# Altium schematic sheet Sensor.SchDoc
size A4; SheetNumber: 2; SheetTotal: 5; SPICEModelCacheXYVLXKKP: <root> / <DocumentId>XYVLXKKP</DocumentId> / <CacheFrame Number="0"> / <Model Name="2n3904" Kind="MDL"> / <Text>*2N3904 / *Si 310mW  40V 200mA 300MHz pkg:TO-92B 1,2,3 / .MODEL 2N3904 NPN(IS=1.4E-14 BF=300 VAF=100 IKF=0.025 ISE=3E-13 / + BR=7.5 RC=2.4 CJE=4.5E-12 TF=4E-10 CJC=3.5E-12 TR=2.1E-8 XTB=1.5 KF=9E-16 )</Text> / </Model> / </CacheFrame> / </root>
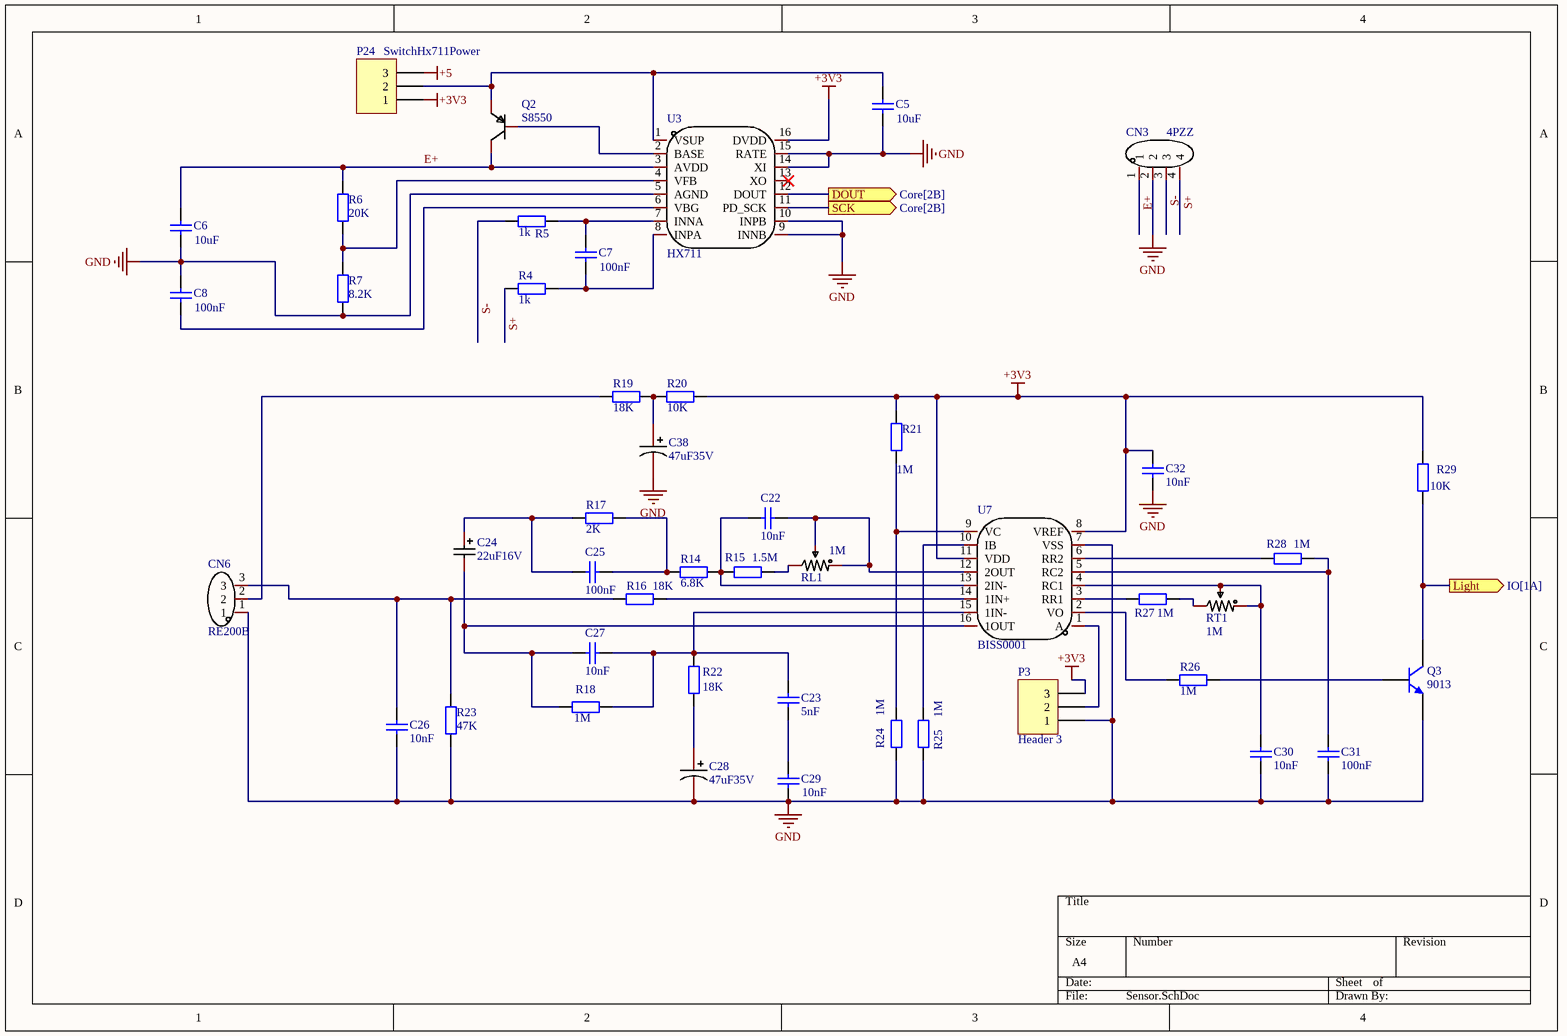
[diagram p0: Sensor.SchDoc]

## Parts
C5  value 10uF  [6-0805_N]  (hidden comment: Cap)
C6  value 10uF  [6-0805_N]  (hidden comment: Cap)
C7  value 100nF  [6-0805_N]  (hidden comment: Cap)
C8  value 100nF  [6-0805_N]  (hidden comment: Cap)
C22  value 10nF  [6-0805_N]  (hidden comment: Cap)
C23  value 5nF  [6-0805_N]  (hidden comment: Cap)
C24  Name: 22uF16V  [CASE-B_3528]  (hidden comment: 22uF)
C25  value 100nF  [6-0805_N]  (hidden comment: Cap)
C26  value 10nF  [6-0805_N]  (hidden comment: Cap)
C27  value 10nF  [6-0805_N]  (hidden comment: Cap)
C28  Name: 47uF35V  [CAP-TH_BD5.0-P2.00-D0.5-FD-A]  (hidden comment: 47uF)
C29  value 10nF  [6-0805_N]  (hidden comment: Cap)
C30  value 10nF  [6-0805_N]  (hidden comment: Cap)
C31  value 100nF  [6-0805_N]  (hidden comment: Cap)
C32  value 10nF  [6-0805_N]  (hidden comment: Cap)
C38  Name: 47uF35V  [CAP-TH_BD5.0-P2.00-D0.5-FD-A]  (hidden comment: 47uF)
CN3  Name: 4PZZ  [CONN-TH_4P-P2.50_4PIN]  (hidden comment: ZX-XH2.54-4PZZ)
CN6  Name: RE200B  [CONN-TH_3P-P2.54_2501S-3P]  (hidden comment: ZX-XH2.54-3PZZ)
P3  Header 3  [HDR1X3]
P24  SwitchHx711Power  [HDR1X3]
Q2  S8550  [SOT-23-3_L2.9-W1.3-P1.90-LS2.4-BR]
Q3  9013  [SOT-23-3_L2.9-W1.3-P1.90-LS2.4-BR]
R4  value 1k  [6-0805_N]  (hidden comment: Res2)
R5  value 1k  [6-0805_N]  (hidden comment: Res2)
R6  value 20K  [6-0805_N]  (hidden comment: Res2)
R7  value 8.2K  [6-0805_N]  (hidden comment: Res2)
R14  value 6.8K  [6-0805_N]  (hidden comment: Res2)
R15  value 1.5M  [6-0805_N]  (hidden comment: Res2)
R16  value 18K  [6-0805_N]  (hidden comment: Res2)
R17  value 2K  [6-0805_N]  (hidden comment: Res2)
R18  value 1M  [6-0805_N]  (hidden comment: Res2)
R19  value 18K  [6-0805_N]  (hidden comment: Res2)
R20  value 10K  [6-0805_N]  (hidden comment: Res2)
R21  value 1M  [6-0805_N]  (hidden comment: Res2)
R22  value 18K  [6-0805_N]  (hidden comment: Res2)
R23  value 47K  [6-0805_N]  (hidden comment: Res2)
R24  value 1M  [6-0805_N]  (hidden comment: Res2)
R25  value 1M  [6-0805_N]  (hidden comment: Res2)
R26  value 1M  [6-0805_N]  (hidden comment: Res2)
R27  value 1M  [6-0805_N]  (hidden comment: Res2)
R28  value 1M  [6-0805_N]  (hidden comment: Res2)
R29  value 10K  [6-0805_N]  (hidden comment: Res2)
RL1  Name: 1M  [RES-ADJ-TH_3P-L10.0-W10.0-P2.50-L]  (hidden comment: 10kΩ)
RT1  Name: 1M  [RES-ADJ-TH_3P-L10.0-W10.0-P2.50-L]  (hidden comment: 10kΩ)
U3  HX711  [SOP-16_L10.0-W3.9-P1.27-LS6.0-BL]
U7  BISS0001  [SOP-16_L10.0-W3.9-P1.27-LS6.0-BL]

## Ports
DOUT (out, see Core[2B]), Light (out, see IO[1A]), SCK (out, see Core[2B])

## Nets
+3V3: C32.1 P3.3 P24.1 R20.2 R21.1 R29.1 U3.16(DVDD) U7.8(VREF) U7.11(VDD)
+5: P24.3
GND: C5.1 C6.1 C8.2 C26.2 C28.2 C29.1 C30.2 C31.2 C32.2 C38.2 CN3.2 CN6.1 P3.1 Q3.1(E) R7.1 R23.2 R24.2 R25.2 U3.5(AGND) U3.9(INNB) U3.10(INPB) U3.14(XI) U3.15(RATE) U7.7(VSS)
DOUT: U3.12(DOUT) ; port DOUT
E+: C6.2 CN3.1 Q2.3(C) R6.1 U3.3(AVDD)
Light: Q3.3(C) R29.2 ; port Light
S+: CN3.4 R4.2
S-: CN3.3 R5.2
SCK: U3.11(PD_SCK) ; port SCK
NetC5_2: C5.2 P24.2 Q2.2(E) U3.1(VSUP)
NetC7_1: C7.1 R4.1 U3.8(INPA)
NetC7_2: C7.2 R5.1 U3.7(INNA)
NetC8_1: C8.1 U3.6(VBG)
NetC22_1: C22.1 R14.2 R15.1 U7.13(2IN-)
NetC22_2: C22.2 RL1.1 RL1.2 U7.12(2OUT)
NetC23_1: C23.1 C27.1 R18.1 R22.1 U7.15(1IN-)
NetC23_2: C23.2 C29.2
NetC24_1: C24.1 C25.1 R17.1
NetC24_2: C24.2 C27.2 R18.2 U7.16(1OUT)
NetC25_2: C25.2 R14.1 R17.2
NetC26_1: C26.1 CN6.3 R16.2 R23.1
NetC28_1: C28.1 R22.2
NetC30_1: C30.1 RT1.1 RT1.2 U7.4(RC1)
NetC31_1: C31.1 R28.2 U7.5(RC2)
NetC38_1: C38.1 R19.2 R20.1
NetCN6_2: CN6.2 R19.1
NetP3_2: P3.2 U7.1(A)
NetQ2_1: Q2.1(B) U3.2(BASE)
NetQ3_2: Q3.2(B) R26.2
NetR6_2: R6.2 R7.2 U3.4(VFB)
NetR15_2: R15.2 RL1.3
NetR16_1: R16.1 U7.14(1IN+)
NetR21_2: R21.2 R24.1 U7.9(VC)
NetR25_1: R25.1 U7.10(IB)
NetR26_1: R26.1 U7.2(VO)
NetR27_1: R27.1 U7.3(RR1)
NetR27_2: R27.2 RT1.3
NetR28_1: R28.1 U7.6(RR2)

Not connected (* = marked no-connect by the designer): U3 13(XO)*

## Library data of the parts
C5-C8 C22 C23 C25-C27 C29-C32 = Cap: Capacitor; Published: 8-Jun-2000; LatestRevisionDate: 17-Jul-2002; LatestRevisionNote: Re-released for DXP Platform.; PackageReference: RAD-0.3; Publisher: Altium Limited; PackageDescription: Radial Cap, Thru-Hole; 2 Leads; 0.3 in Pin Spacing
C24 = TAJB226K016RNJ: Manufacturer: Kyocera AVX; Add into BOM: yes; Tolerance: ±10%; Rated Voltage: 16V; Equivalent Series Resistance(ESR): 2.3Ω@100kHz; Symbol: TAJB226K016RNJ; Device: TAJB226K016RNJ; LCSC Part Name: 22uF ±10% 16V; Supplier Part: C8020; Manufacturer Part: TAJB226K016RNJ; Supplier Footprint: CASE-B-3528; JLCPCB Part Class: 扩展库; Datasheet: https://atta.szlcsc.com/upload/public/pdf/source/20160107/1457707750344.pdf; Supplier: LCSC; Convert to PCB: yes; Value: 22uF; Operating Temperature: -55℃~+125℃
C28 C38 = 01EC1119: Manufacturer: KNSCHA(科尼盛); Add into BOM: yes; Tolerance: ±20%; Rated Voltage: 35V; Ripple Current: 135mA@100kHz; Equivalent Series Resistance(ESR): 1Ω@100kHz; φD: 5mm; L: 11mm; Lifetime @ Temp: 7000hrs@105℃; Symbol: 01EC1119; Device: 01EC1119; LCSC Part Name: 47uF ±20% 35V; Supplier Part: C2833295; Manufacturer Part: 01EC1119; Supplier Footprint: 插件,D5xL11mm; JLCPCB Part Class: 扩展库; Datasheet: https://atta.szlcsc.com/upload/public/pdf/source/20210521/C2833295_D5EF56CA4AAF67B2F3976F630DF1C3A7.pdf; Supplier: LCSC; Convert to PCB: yes; Value: 47uF; Lead Spacing: 2mm; Operating Temperature: -55℃~+105℃
CN3 = ZX-XH2.54-4PZZ: Manufacturer: Megastar(兆星); Add into BOM: yes; Pins Structure: 1x4P; Pitch: 2.54mm; Reference Series: XH; Number of PINs Per Row: 4; Current Rating (Max): 3A; Symbol: ZX-XH2.54-4PZZ; Device: ZX-XH2.54-4PZZ; LCSC Part Name: ZX-XH2.54-4PZZ; Supplier Part: C7429634; Manufacturer Part: ZX-XH2.54-4PZZ; Supplier Footprint: 插件,P=2.54mm; JLCPCB Part Class: 扩展库; Datasheet: https://atta.szlcsc.com/upload/public/pdf/source/20230619/B529A2163E0159A644AB3383D208FB03.pdf; Supplier: LCSC; Convert to PCB: yes; Mounting Style: 直插; Number of Pins: 4P; Number of Rows: 1; Row Spacing: -; Contact Material: 黄铜; Contact Plating: 锡; Operating Temperature Range: -25℃~+85℃
CN6 = ZX-XH2.54-3PZZ: Manufacturer: Megastar(兆星); Add into BOM: yes; Pins Structure: 1x3P; Pitch: 2.54mm; Reference Series: XH; Number of PINs Per Row: 3; Current Rating (Max): 3A; Symbol: ZX-XH2.54-3PZZ; Device: ZX-XH2.54-3PZZ; LCSC Part Name: ZX-XH2.54-3PZZ; Supplier Part: C7429633; Manufacturer Part: ZX-XH2.54-3PZZ; Supplier Footprint: 插件,P=2.54mm; JLCPCB Part Class: 扩展库; Datasheet: https://atta.szlcsc.com/upload/public/pdf/source/20230619/AE17037A2CFDBE8D9CBA775D61AD0A84.pdf; Supplier: LCSC; Convert to PCB: yes; Mounting Style: 直插; Number of Pins: 3P; Number of Rows: 1; Row Spacing: -; Contact Material: 黄铜; Contact Plating: 锡; Operating Temperature Range: -25℃~+85℃
P3 P24 = Header 3: Header, 3-Pin; LatestRevisionDate: 17-Jul-2002; LatestRevisionNote: Re-released for DXP Platform.; Publisher: Altium Limited
Q2 = S8550_C20069126: Manufacturer: 宏迦橙; Add into BOM: yes; Transistor Type: PNP; Collector Current (Ic): 500mA; Collector-Emitter Breakdown Voltage (Vceo): 25V; Power Dissipation (Pd): 300mW; DC Current Gain (hFE@Ic,Vce): 120@500mA,1.0V; Transition Frequency (fT): 150MHz; Collector Cut-Off Current (Icbo): 100nA; Collector-Emitter Saturation Voltage (VCE(sat)@Ic,Ib): 500mV@1.0A,50mA; Symbol: S8550_C20069126; Device: S8550_C20069126; LCSC Part Name: PNP 电流:500mA 耐压:25V; Supplier Part: C20069126; Manufacturer Part: S8550; Supplier Footprint: SOT-23; JLCPCB Part Class: 扩展库; Datasheet: https://atta.szlcsc.com/upload/public/pdf/source/20231229/A44F382554E15234B24C32D7C3971EED.pdf; Supplier: LCSC; Convert to PCB: yes; Operating Temperature: -55℃~+150℃; Name: S8550
Q3 = 2N3904: NPN General Purpose Amplifier; Published: 8-Jun-2000; LatestRevisionDate: 15-Jan-2003; LatestRevisionNote: PCB Footprint 'BCY-W3/D4.7' replaced; DatasheetVersion: 1997; PackageVersion: Sep-1998; PackageReference: TO-92A; Publisher: Altium Limited; PackageDescription: TO, Flat Index; 3 In-Line, Axial Leads; Body Dia. 4.5mm; Leads 0.51 x 0.48 mm (max); ComponentLink1Description: Manufacturer Link; ComponentLink1URL: http://www.fairchildsemi.com/; ComponentLink2Description: Datasheet; ComponentLink2URL: http://www.fairchildsemi.com/ds/2N%2F2N3904.pdf
R4-R7 R14-R29 = Res2: Resistor; Published: 8-Jun-2000; LatestRevisionDate: 17-Jul-2002; LatestRevisionNote: Re-released for DXP Platform.; PackageReference: AXIAL-0.4; Publisher: Altium Limited; PackageDescription: Axial Device, Thru-Hole; 2 Leads; 0.4 in Pin Spacing
RL1 RT1 = 3296W-1-103: Manufacturer: BOCHEN(博晨); Add into BOM: yes; Tolerance: ±10%; Symbol: 3296W-1-103; Device: 3296W-1-103; LCSC Part Name: 10kΩ ±10%; Supplier Part: C118954; Manufacturer Part: 3296W-1-103; Supplier Footprint: 插件; JLCPCB Part Class: 扩展库; Datasheet: https://atta.szlcsc.com/upload/public/pdf/source/20171114/C118954_15106326646611117443.pdf; Supplier: LCSC; Convert to PCB: yes; Value: 10kΩ
U3 = HX711_C6705483: Manufacturer: AVIA(海芯科技); Add into BOM: yes; Symbol: HX711_C6705483; Device: HX711_C6705483; LCSC Part Name: HX711; Supplier Part: C6705483; Manufacturer Part: HX711; Supplier Footprint: SOP-16; JLCPCB Part Class: 扩展库; Supplier: LCSC; Convert to PCB: yes; Name: HX711
U7 = BISS0001: Manufacturer: UMW(友台半导体); Symbol: BISS0001_C404323; Add into BOM: yes; Device: BISS0001; LCSC Part Name: 红外传感信号处理器; Supplier Part: C404323; Manufacturer Part: BISS0001; Supplier Footprint: SOP-16; JLCPCB Part Class: 扩展库; Datasheet: https://atta.szlcsc.com/upload/public/pdf/source/20231109/48CCA2F2187B39D45C76AC1FEDDCACA0.pdf; Supplier: LCSC; Convert to PCB: yes; Name: BISS0001